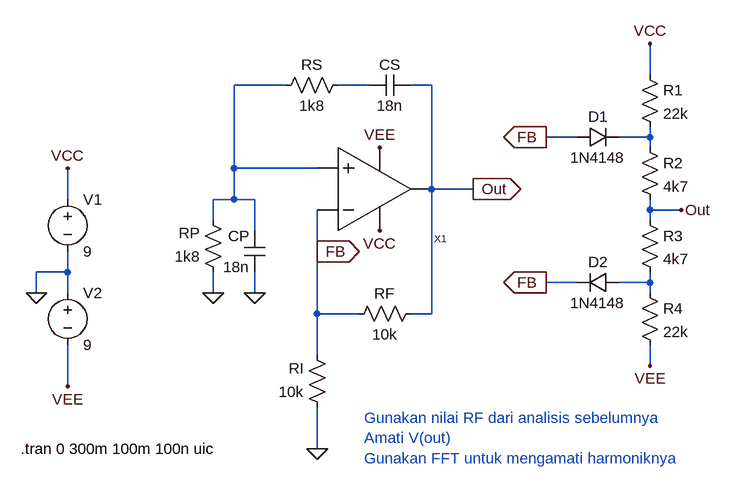
[diagram p0: schematic Perc-4-1-WienWithLimiter.asc]
Perc-4-1-WienWithLimiter.asc, the LTspice schematic file:
Version 4
SHEET 1 1052 680
WIRE 720 64 720 16
WIRE 160 80 80 80
WIRE 288 80 240 80
WIRE 384 80 352 80
WIRE 608 160 560 160
WIRE 720 160 720 144
WIRE 720 160 672 160
WIRE 720 176 720 160
WIRE 80 208 80 80
WIRE 208 208 80 208
WIRE 384 240 384 80
WIRE 448 240 384 240
WIRE -176 256 -176 208
WIRE 80 256 80 208
WIRE 80 256 48 256
WIRE 112 256 80 256
WIRE 720 272 720 256
WIRE 768 272 720 272
WIRE 48 288 48 256
WIRE 720 288 720 272
WIRE 112 304 112 256
WIRE 208 336 208 272
WIRE -176 368 -176 336
WIRE -176 368 -224 368
WIRE 608 384 560 384
WIRE 720 384 720 368
WIRE 720 384 672 384
WIRE -224 400 -224 368
WIRE -176 400 -176 368
WIRE 48 400 48 368
WIRE 112 400 112 368
WIRE 720 400 720 384
WIRE 208 432 208 336
WIRE 272 432 208 432
WIRE 384 432 384 240
WIRE 384 432 352 432
WIRE 208 496 208 432
WIRE 720 512 720 480
WIRE -176 544 -176 480
WIRE 208 640 208 576
FLAG 208 640 0
FLAG 48 400 0
FLAG 112 400 0
FLAG -224 400 0
FLAG -176 208 VCC
FLAG -176 544 VEE
FLAG 304 304 VCC
FLAG 304 176 VEE
FLAG 448 240 Out
IOPIN 448 240 Out
FLAG 720 16 VCC
FLAG 720 512 VEE
FLAG 768 272 Out
FLAG 560 160 FB
IOPIN 560 160 Out
FLAG 560 384 FB
IOPIN 560 384 Out
FLAG 208 336 FB
IOPIN 208 336 Out
SYMBOL res 64 384 R180
WINDOW 0 36 76 Left 2
WINDOW 3 36 40 Left 2
SYMATTR InstName RP
SYMATTR Value 1k8
SYMBOL cap 128 368 R180
WINDOW 0 24 56 Left 2
WINDOW 3 24 8 Left 2
SYMATTR InstName CP
SYMATTR Value 18n
SYMBOL res 368 416 R90
WINDOW 0 0 56 VBottom 2
WINDOW 3 32 56 VTop 2
SYMATTR InstName RF
SYMATTR Value 10k
SYMBOL res 224 592 R180
WINDOW 0 36 76 Left 2
WINDOW 3 36 40 Left 2
SYMATTR InstName RI
SYMATTR Value 10k
SYMBOL res 256 64 R90
WINDOW 0 0 56 VBottom 2
WINDOW 3 32 56 VTop 2
SYMATTR InstName RS
SYMATTR Value 1k8
SYMBOL cap 352 64 R90
WINDOW 0 0 32 VBottom 2
WINDOW 3 32 32 VTop 2
SYMATTR InstName CS
SYMATTR Value 18n
SYMBOL voltage -176 240 R0
WINDOW 123 0 0 Left 0
WINDOW 39 0 0 Left 0
SYMATTR InstName V1
SYMATTR Value 9
SYMBOL voltage -176 384 R0
WINDOW 123 0 0 Left 0
WINDOW 39 0 0 Left 0
SYMATTR InstName V2
SYMATTR Value 9
SYMBOL res 704 48 R0
SYMATTR InstName R1
SYMATTR Value 22k
SYMBOL res 704 160 R0
SYMATTR InstName R2
SYMATTR Value 4k7
SYMBOL res 704 272 R0
SYMATTR InstName R3
SYMATTR Value 4k7
SYMBOL res 704 384 R0
SYMATTR InstName R4
SYMATTR Value 22k
SYMBOL diode 608 144 M90
WINDOW 0 0 32 VBottom 2
WINDOW 3 32 32 VTop 2
SYMATTR InstName D1
SYMATTR Value 1N4148
SYMBOL diode 672 368 R90
WINDOW 0 0 32 VBottom 2
WINDOW 3 32 32 VTop 2
SYMATTR InstName D2
SYMATTR Value 1N4148
SYMBOL Opampku 288 240 M180
SYMATTR InstName X1
TEXT -248 640 Left 2 !.tran 0 300m 100m 100n uic
TEXT 280 592 Left 2 ;Gunakan nilai RF dari analisis sebelumnya\nAmati V(out)\nGunakan FFT untuk mengamati harmoniknya

The netlist it stands for:
* Perc-4-1-WienWithLimiter.asc
RP 0 N001 1k8
CP 0 N001 18n
RF Out FB 10k
RI 0 FB 10k
RS N002 N001 1k8
CS Out N002 18n
V1 VCC 0 9
V2 0 VEE 9
R1 VCC N003 22k
R2 N003 Out 4k7
R3 Out N004 4k7
R4 N004 VEE 22k
D1 FB N003 1N4148
D2 N004 FB 1N4148
XX1 FB N001 VCC VEE Out Opampku  ; pins inn inp vp vn out
.model D D
.lib standard.dio
.tran 0 300m 100m 100n uic
* Gunakan nilai RF dari analisis sebelumnya
* Amati V(out)
* Gunakan FFT untuk mengamati harmoniknya
.backanno
.end